# EAGLE schematic SP Display Line 0603 (EAGLE 9.6.2)
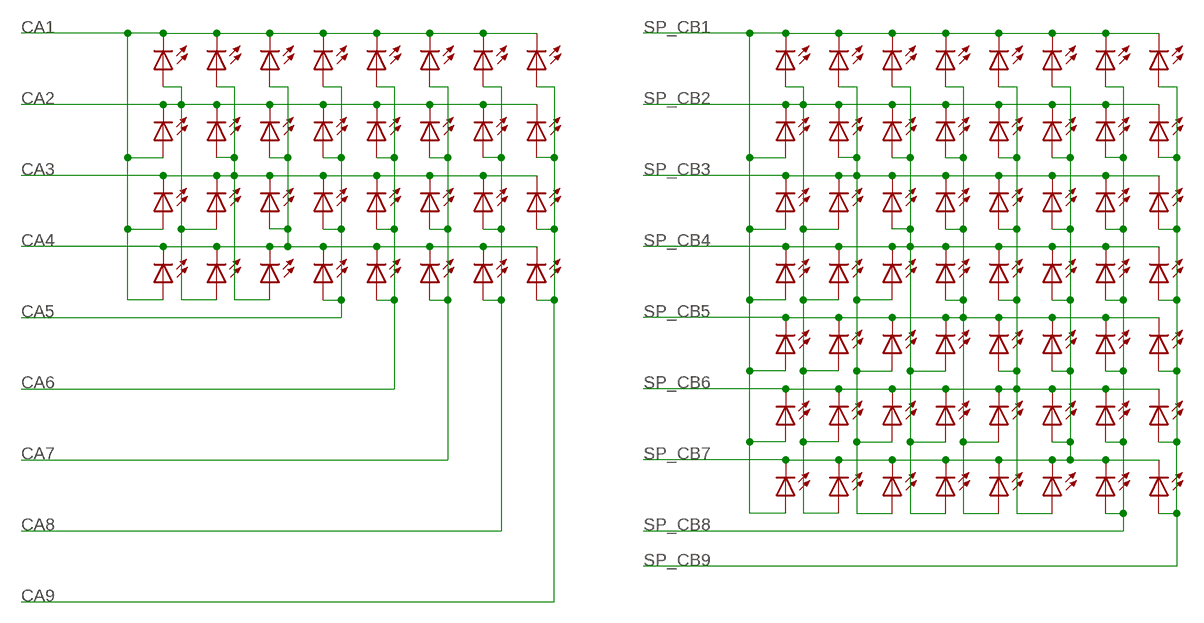
[diagram p0: schematic, sheet 1]

## Parts
LED_A1  LEDSMT0603_1  [CHIPLED_0603]
LED_A2  LEDSMT0603_1  [CHIPLED_0603]
LED_B1  LEDSMT0603_1  [CHIPLED_0603]
LED_B2  LEDSMT0603_1  [CHIPLED_0603]
LED_C1  LEDSMT0603_1  [CHIPLED_0603]
LED_C2  LEDSMT0603_1  [CHIPLED_0603]
LED_D1  LEDSMT0603_1  [CHIPLED_0603]
LED_D2  LEDSMT0603_1  [CHIPLED_0603]
LED_DA1  LEDSMT0603_1  [CHIPLED_0603]
LED_DA2  LEDSMT0603_1  [CHIPLED_0603]
LED_DA3  LEDSMT0603_1  [CHIPLED_0603]
LED_DA4  LEDSMT0603_1  [CHIPLED_0603]
LED_DA5  LEDSMT0603_1  [CHIPLED_0603]
LED_DA6  LEDSMT0603_1  [CHIPLED_0603]
LED_DA7  LEDSMT0603_1  [CHIPLED_0603]
LED_DB1  LEDSMT0603_1  [CHIPLED_0603]
LED_DB2  LEDSMT0603_1  [CHIPLED_0603]
LED_DB3  LEDSMT0603_1  [CHIPLED_0603]
LED_DB4  LEDSMT0603_1  [CHIPLED_0603]
LED_DB5  LEDSMT0603_1  [CHIPLED_0603]
LED_DB6  LEDSMT0603_1  [CHIPLED_0603]
LED_DB7  LEDSMT0603_1  [CHIPLED_0603]
LED_DC1  LEDSMT0603_1  [CHIPLED_0603]
LED_DC2  LEDSMT0603_1  [CHIPLED_0603]
LED_DC3  LEDSMT0603_1  [CHIPLED_0603]
LED_DC4  LEDSMT0603_1  [CHIPLED_0603]
LED_DC5  LEDSMT0603_1  [CHIPLED_0603]
LED_DC6  LEDSMT0603_1  [CHIPLED_0603]
LED_DC7  LEDSMT0603_1  [CHIPLED_0603]
LED_DD1  LEDSMT0603_1  [CHIPLED_0603]
LED_DD2  LEDSMT0603_1  [CHIPLED_0603]
LED_DD3  LEDSMT0603_1  [CHIPLED_0603]
LED_DD4  LEDSMT0603_1  [CHIPLED_0603]
LED_DD5  LEDSMT0603_1  [CHIPLED_0603]
LED_DD6  LEDSMT0603_1  [CHIPLED_0603]
LED_DD7  LEDSMT0603_1  [CHIPLED_0603]
LED_DE1  LEDSMT0603_1  [CHIPLED_0603]
LED_DE2  LEDSMT0603_1  [CHIPLED_0603]
LED_DE3  LEDSMT0603_1  [CHIPLED_0603]
LED_DE4  LEDSMT0603_1  [CHIPLED_0603]
LED_DE5  LEDSMT0603_1  [CHIPLED_0603]
LED_DE6  LEDSMT0603_1  [CHIPLED_0603]
LED_DE7  LEDSMT0603_1  [CHIPLED_0603]
LED_DF1  LEDSMT0603_1  [CHIPLED_0603]
LED_DF2  LEDSMT0603_1  [CHIPLED_0603]
LED_DF3  LEDSMT0603_1  [CHIPLED_0603]
LED_DF4  LEDSMT0603_1  [CHIPLED_0603]
LED_DF5  LEDSMT0603_1  [CHIPLED_0603]
LED_DF6  LEDSMT0603_1  [CHIPLED_0603]
LED_DF7  LEDSMT0603_1  [CHIPLED_0603]
LED_DG1  LEDSMT0603_1  [CHIPLED_0603]
LED_DG2  LEDSMT0603_1  [CHIPLED_0603]
LED_DG3  LEDSMT0603_1  [CHIPLED_0603]
LED_DG4  LEDSMT0603_1  [CHIPLED_0603]
LED_DG5  LEDSMT0603_1  [CHIPLED_0603]
LED_DG6  LEDSMT0603_1  [CHIPLED_0603]
LED_DG7  LEDSMT0603_1  [CHIPLED_0603]
LED_DP1  LEDSMT0603_1  [CHIPLED_0603]
LED_DP2  LEDSMT0603_1  [CHIPLED_0603]
LED_DP3  LEDSMT0603_1  [CHIPLED_0603]
LED_DP4  LEDSMT0603_1  [CHIPLED_0603]
LED_DP5  LEDSMT0603_1  [CHIPLED_0603]
LED_DP6  LEDSMT0603_1  [CHIPLED_0603]
LED_DP7  LEDSMT0603_1  [CHIPLED_0603]
LED_E1  LEDSMT0603_1  [CHIPLED_0603]
LED_E2  LEDSMT0603_1  [CHIPLED_0603]
LED_F1  LEDSMT0603_1  [CHIPLED_0603]
LED_F2  LEDSMT0603_1  [CHIPLED_0603]
LED_G1  LEDSMT0603_1  [CHIPLED_0603]
LED_G2  LEDSMT0603_1  [CHIPLED_0603]
LED_H1  LEDSMT0603_1  [CHIPLED_0603]
LED_H2  LEDSMT0603_1  [CHIPLED_0603]
LED_K1  LEDSMT0603_1  [CHIPLED_0603]
LED_K2  LEDSMT0603_1  [CHIPLED_0603]
LED_M1  LEDSMT0603_1  [CHIPLED_0603]
LED_M2  LEDSMT0603_1  [CHIPLED_0603]
LED_N1  LEDSMT0603_1  [CHIPLED_0603]
LED_N2  LEDSMT0603_1  [CHIPLED_0603]
LED_P1  LEDSMT0603_1  [CHIPLED_0603]
LED_P2  LEDSMT0603_1  [CHIPLED_0603]
LED_R1  LEDSMT0603_1  [CHIPLED_0603]
LED_R2  LEDSMT0603_1  [CHIPLED_0603]
LED_S1  LEDSMT0603_1  [CHIPLED_0603]
LED_S2  LEDSMT0603_1  [CHIPLED_0603]
LED_T1  LEDSMT0603_1  [CHIPLED_0603]
LED_T2  LEDSMT0603_1  [CHIPLED_0603]
LED_U1  LEDSMT0603_1  [CHIPLED_0603]
LED_U2  LEDSMT0603_1  [CHIPLED_0603]

## Nets
CA1: LED_A1.C LED_A2.A LED_B1.C LED_C1.C LED_D1.C LED_E1.C LED_F1.C LED_G1.C LED_H1.C LED_K1.A LED_K2.A
CA2: LED_A1.A LED_B2.A LED_K1.C LED_M1.C LED_M2.A LED_N1.C LED_P1.C LED_R1.C LED_S1.C LED_T1.C LED_U1.C
CA3: LED_A2.C LED_B1.A LED_B2.C LED_C2.C LED_D2.C LED_E2.C LED_F2.C LED_G2.C LED_H2.C LED_M1.A LED_N2.A
CA4: LED_C1.A LED_C2.A LED_K2.C LED_M2.C LED_N1.A LED_N2.C LED_P2.C LED_R2.C LED_S2.C LED_T2.C LED_U2.C
CA5: LED_D1.A LED_D2.A LED_P1.A LED_P2.A
CA6: LED_E1.A LED_E2.A LED_R1.A LED_R2.A
CA7: LED_F1.A LED_F2.A LED_S1.A LED_S2.A
CA8: LED_G1.A LED_G2.A LED_T1.A LED_T2.A
CA9: LED_H1.A LED_H2.A LED_U1.A LED_U2.A
SP_CB1: LED_DA1.C LED_DA2.A LED_DA3.A LED_DA4.A LED_DA5.A LED_DA6.A LED_DA7.A LED_DB1.C LED_DC1.C LED_DD1.C LED_DE1.C LED_DF1.C LED_DG1.C LED_DP1.C
SP_CB2: LED_DA1.A LED_DA2.C LED_DB2.C LED_DB3.A LED_DB4.A LED_DB5.A LED_DB6.A LED_DB7.A LED_DC2.C LED_DD2.C LED_DE2.C LED_DF2.C LED_DG2.C LED_DP2.C
SP_CB3: LED_DA3.C LED_DB1.A LED_DB2.A LED_DB3.C LED_DC3.C LED_DC4.A LED_DC5.A LED_DC6.A LED_DC7.A LED_DD3.C LED_DE3.C LED_DF3.C LED_DG3.C LED_DP3.C
SP_CB4: LED_DA4.C LED_DB4.C LED_DC1.A LED_DC2.A LED_DC3.A LED_DC4.C LED_DD4.C LED_DD5.A LED_DD6.A LED_DD7.A LED_DE4.C LED_DF4.C LED_DG4.C LED_DP4.C
SP_CB5: LED_DA5.C LED_DB5.C LED_DC5.C LED_DD1.A LED_DD2.A LED_DD3.A LED_DD4.A LED_DD5.C LED_DE5.C LED_DE6.A LED_DE7.A LED_DF5.C LED_DG5.C LED_DP5.C
SP_CB6: LED_DA6.C LED_DB6.C LED_DC6.C LED_DD6.C LED_DE1.A LED_DE2.A LED_DE3.A LED_DE4.A LED_DE5.A LED_DE6.C LED_DF6.C LED_DF7.A LED_DG6.C LED_DP6.C
SP_CB7: LED_DA7.C LED_DB7.C LED_DC7.C LED_DD7.C LED_DE7.C LED_DF1.A LED_DF2.A LED_DF3.A LED_DF4.A LED_DF5.A LED_DF6.A LED_DF7.C LED_DG7.C LED_DP7.C
SP_CB8: LED_DG1.A LED_DG2.A LED_DG3.A LED_DG4.A LED_DG5.A LED_DG6.A LED_DG7.A
SP_CB9: LED_DP1.A LED_DP2.A LED_DP3.A LED_DP4.A LED_DP5.A LED_DP6.A LED_DP7.A

## Library data of the parts
LED_A1 LED_A2 LED_B1 LED_B2 LED_C1 LED_C2 LED_D1 LED_D2 LED_DA1-LED_DA7 LED_DB1-LED_DB7 LED_DC1-LED_DC7 LED_DD1-LED_DD7 LED_DE1-LED_DE7 LED_DF1-LED_DF7 LED_DG1-LED_DG7 LED_DP1-LED_DP7 LED_E1 LED_E2 LED_F1 LED_F2 LED_G1 LED_G2 LED_H1 LED_H2 LED_K1 LED_K2 LED_M1 LED_M2 LED_N1 LED_N2 LED_P1 LED_P2 LED_R1 LED_R2 LED_S1 LED_S2 LED_T1 LED_T2 LED_U1 LED_U2 = 000_nl2:LED: LED KINGBRIGHT: KPTL-3216 are the reverse LEDs Source: www.kingbright.com